# EasyEDA Pro project 扩展板测试.epro

# Board 电机驱动MX1616H
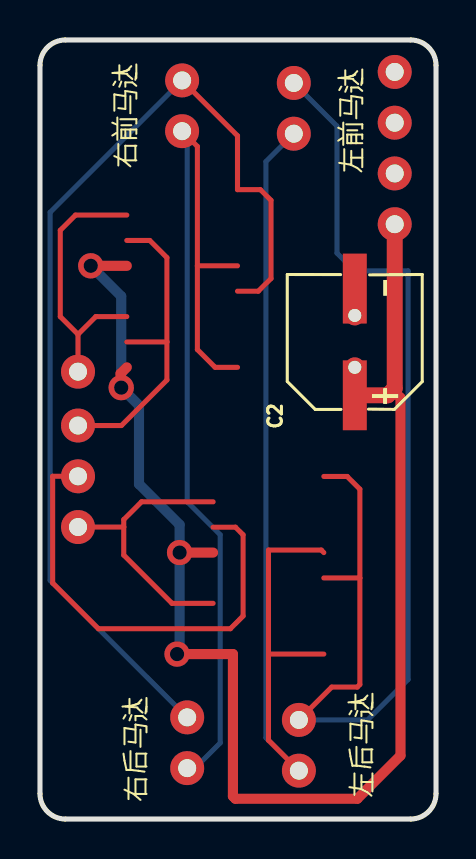
[diagram p0: board, top side]
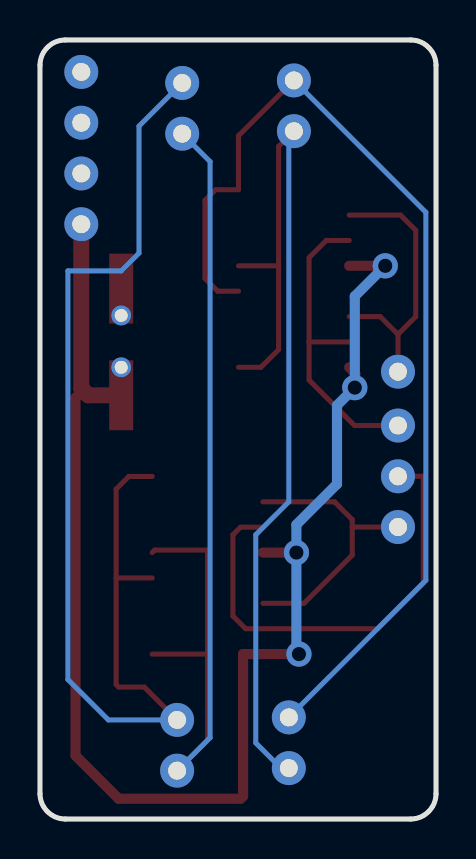
[diagram p1: board, bottom side, seen from below]

Outline 19.81 x 38.99 mm; copper layers: Top Layer, Bottom Layer. Coordinates in mm from the lower left corner of the outline.
Outline path: 0,37.72 0,1.27 arc(0.37,0.37) 1.27,0 18.54,0 arc(19.44,0.37) 19.81,1.27 19.81,37.72 arc(19.44,38.62) 18.54,38.99 1.27,38.99 arc(0.37,38.62) 0,37.72
Stack: Top Layer 0.0356mm / Dielectric1 0.32mm FR-4 er 4.8 / Bottom Layer 0.0356mm

## Design rules (mm)
template: 用户自定义配置
spacing Clearance (default): track to track 0.254, other pairs 0 to 0.254
track width Width (default): min 0.254, default 0.508, max 1.27
differential pair DiffPairsRouting (default): width min 0.381, default 0.381, max 0.381; gap min 0.254, default 0.254
via RoutingVias (default): diameter min 1.27, default 1.27, max 1.27; hole min 0.711, default 0.711, max 0.711

## Placement (name value [footprint] x y rotation side)
C2  100uF  [CAP-SMD_BD6.3-L6.6-W6.6-FD]  15.75 23.88 90 top
NOREF  -  [Pad_ie15]  17.75 32.31 90 top
NOREF#2  -  [Pad_ie143]  1.9 22.39 90 top
NOREF#3  -  [Pad_ie129]  7.36 2.55 90 top
NOREF#4  -  [Pad_ie142]  1.9 17.15 90 top
NOREF#5  -  [Pad_ie11]  1.9 19.69 90 top
NOREF#6  -  [Pad_ie9]  1.9 14.61 90 top
NOREF#7  -  [Pad_ie7]  12.95 4.96 90 top
NOREF#8  -  [Pad_ie14]  17.75 34.85 90 top
NOREF#9  -  [Pad_ie2]  12.7 36.84 90 top
NOREF#10  -  [Pad_ie4]  7.11 36.97 90 top
NOREF#11  -  [Pad_ie5]  7.36 5.09 90 top
NOREF#12  -  [Pad_ie1]  15.75 22.61 90 top
NOREF#13  -  [Pad_ie16]  17.75 29.77 90 top
NOREF#14  -  [Pad_ie145]  12.7 34.3 90 top
NOREF#15  -  [Pad_ie13]  17.75 37.39 90 top
NOREF#16  -  [Pad_ie3]  7.11 34.42 90 top
NOREF#17  -  [Pad_ie0]  15.75 25.2 90 top
NOREF#18  -  [Pad_ie8]  12.95 2.42 90 top

## Footprints (pads in the part's own frame, mm; a bottom-side part is the same pattern mirrored in y, then rotated)
CAP-SMD_BD6.3-L6.6-W6.6-FD
  rect 3.5x1.2 smd: 1(-2.67,0) 2(2.67,0)
Pad_ie0
  round 1 hole 0.65: 0(0,0)
Pad_ie1
  round 1 hole 0.65: 0(0,0)
Pad_ie2
  round 1.7 hole 0.9: 0(0,0)
Pad_ie3
  round 1.7 hole 0.9: 0(0,0)
Pad_ie4
  round 1.7 hole 0.9: 0(0,0)
Pad_ie5
  round 1.7 hole 0.9: 0(0,0)
Pad_ie7
  round 1.7 hole 0.9: 0(0,0)
Pad_ie8
  round 1.7 hole 0.9: 0(0,0)
Pad_ie9
  round 1.7 hole 0.9: 0(0,0)
Pad_ie11
  round 1.7 hole 0.9: 0(0,0)
Pad_ie13
  round 1.7 hole 0.9: 0(0,0)
Pad_ie14
  round 1.7 hole 0.9: 0(0,0)
Pad_ie15
  round 1.7 hole 0.9: 0(0,0)
Pad_ie16
  round 1.7 hole 0.9: 0(0,0)
Pad_ie129
  round 1.7 hole 0.9: 0(0,0)
Pad_ie142
  round 1.7 hole 0.9: 0(0,0)
Pad_ie143
  round 1.7 hole 0.9: 0(0,0)
Pad_ie145
  round 1.7 hole 0.9: 0(0,0)

## Nets
GND: C2.2 NOREF#8.0 NOREF#17.0
VDD: C2.1 NOREF#12.0 NOREF#13.0
D4: NOREF#2.0
D5: NOREF#5.0
D6: NOREF#4.0
D7: NOREF#6.0
OUT1+: NOREF#7.0 NOREF#9.0
OUT1-: NOREF#14.0 NOREF#18.0
OUT+: NOREF#10.0 NOREF#11.0
OUT-: NOREF#3.0 NOREF#16.0

Pads without a net: NOREF 0; NOREF#15 0

## Via types
v1: diameter 1.27, hole 0.711, Top Layer to Bottom Layer, 4 vias

## Routing (per net, layer and track width the routed paths; a pad name or vN(x,y) marks a point on that pad's centre or on a via; arc(x,y) is an arc through that point)
VDD: length 74
  Top Layer w0.508: v1(6.99,13.34) 8.66,13.34 ; v1(6.86,8.26) 9.65,8.26 9.65,1.14 9.78,1.02 15.88,1.02 18.03,3.17 18.03,21.08 17.65,21.46 ; 4.34,22.61 4.03,22.3 4.03,21.62 v1(4.06,21.59) ; v1(2.54,27.69) 4.34,27.69
  Top Layer w0.8: NOREF#13.0 17.75,21.56 17.4,21.21 C2.1
  Bottom Layer w0.508: v1(6.86,8.26) 6.99,8.38 v1(6.99,13.34) 6.99,14.73 4.95,16.76 4.95,20.7 v1(4.06,21.59) 4.06,26.16 v1(2.54,27.69)
D4: length 13.9
  Top Layer w0.254: 4.34,25.15 2.79,25.15 1.9,24.26 ; 4.34,30.23 1.78,30.23 1.02,29.46 1.02,25.14 1.9,24.26 ; 1.9,24.26 NOREF#2.0
D5: length 15.9
  Top Layer w0.254: 6.35,23.88 4.34,23.88 ; 6.35,23.88 6.35,28.09 5.49,28.96 4.34,28.96 ; 6.35,23.88 6.35,21.97 4.07,19.69 NOREF#5.0
D6: length 23.1
  Top Layer w0.254: NOREF#4.0 0.64,17.15 0.64,11.81 2.92,9.53 9.53,9.53 10.16,10.16 10.16,14.22 9.78,14.61 8.66,14.61
D7: length 14.4
  Top Layer w0.254: 4.19,14.61 4.19,13.21 6.6,10.8 8.66,10.8 ; 4.19,14.61 NOREF#6.0 ; 4.19,14.61 4.19,14.99 5.08,15.88 8.66,15.88
OUT1+: length 57.5
  Top Layer w0.254: 16,12.06 16,16.51 15.37,17.14 14.2,17.14 ; 16,12.06 16,6.73 15.88,6.6 14.6,6.6 NOREF#7.0 ; 16,12.06 14.2,12.06
  Bottom Layer w0.254: NOREF#7.0 16.39,4.96 18.42,6.98 18.42,27.43 15.75,27.43 14.86,28.32 14.86,34.68 NOREF#9.0
OUT1-: length 50.4
  Top Layer w0.254: 14.2,13.34 14.07,13.46 11.43,13.46 11.43,8.26 ; 11.43,8.26 11.43,3.94 NOREF#18.0 ; 11.43,8.26 14.2,8.26
  Bottom Layer w0.254: NOREF#14.0 11.3,32.9 11.3,4.07 NOREF#18.0
OUT+: length 51.8
  Top Layer w0.254: 9.88,26.42 10.92,26.42 11.56,27.05 11.56,30.97 11.03,31.5 9.88,31.5 9.88,34.19 NOREF#10.0
  Bottom Layer w0.254: NOREF#10.0 0.51,30.36 0.51,11.94 NOREF#11.0
OUT-: length 49.2
  Top Layer w0.254: 9.88,22.61 8.76,22.61 7.87,23.5 7.87,27.69 ; 7.87,27.69 9.88,27.69 ; 7.87,27.69 7.87,33.66 NOREF#16.0
  Bottom Layer w0.254: NOREF#16.0 7.36,34.17 7.36,15.88 9.02,14.22 9.02,3.81 7.76,2.55 NOREF#3.0

## Text on the board
Top Silkscreen Layer: 右前马达 | 右后马达 | 左前马达 | 左后马达
